# EAGLE schematic schem (EAGLE 6.5.0)
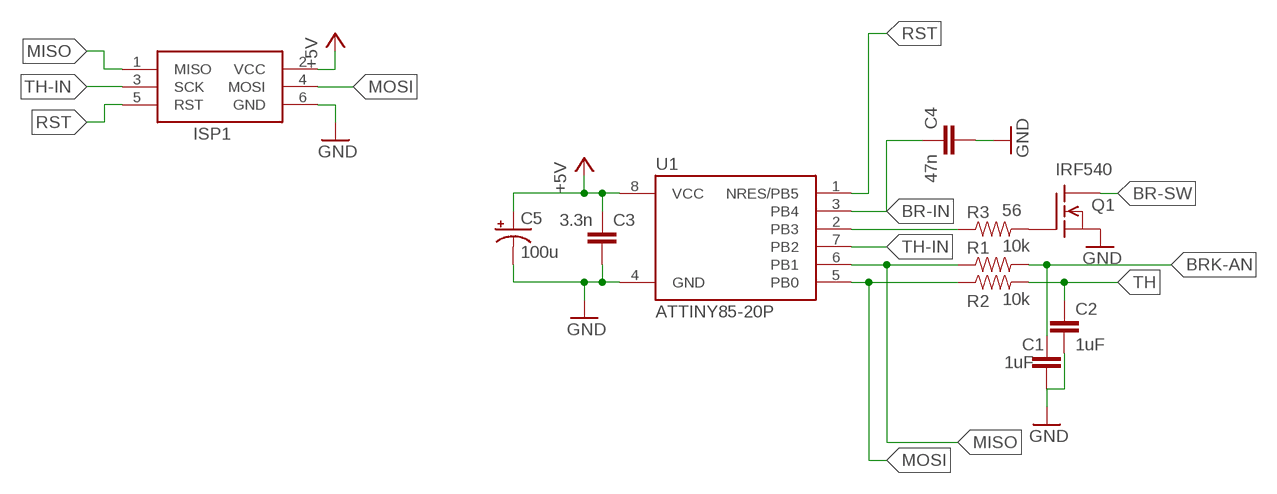
[diagram p0: schematic, sheet 1]

## Parts
C1  1uF  C2.5/6  [C2.5-6]
C2  1uF  C2.5/6  [C2.5-6]
C3  3.3n  CAPEZ  [CAP-PTH-SMALLEZ]
C4  47n  CAPEZ  [CAP-PTH-SMALLEZ]
C5  100u  CPOL-USE2-5  [E2-5]
ISP1  AVRISP-6  [AVRISP]
Q1  IRF540  [TO220]
R1  10k  RESISTORAXIAL-0.3  [AXIAL-0.3]
R2  10k  RESISTORAXIAL-0.3  [AXIAL-0.3]
R3  56  RESISTORAXIAL-0.3  [AXIAL-0.3]
U1  ATTINY85-20P  [PDIP08_300MIL]

## Nets
+5V: C3.1 C5.+ ISP1.2(VCC) U1.8(VCC)
BR-IN: C4.1 U1.3(PB4)
BR-SW: Q1.2(D)
BRK-AN: C1.1 R1.P$2
GND: C2.2 C3.2 C4.2 C5.- ISP1.6(GND) Q1.3(S) U1.4(GND)
MISO: ISP1.1(MISO) R1.P$1 U1.6(PB1)
MOSI: ISP1.4(MOSI) R2.P$1 U1.5(PB0)
N$1: R3.P$1 U1.2(PB3)
N$2: Q1.1(G) R3.P$2
RST: ISP1.5(RST) U1.1(NRES/PB5)
TH: C2.1 R2.P$2
TH-IN: ISP1.3(SCK) U1.7(PB2)
Unconnected: C1.2

## Library data of the parts
C1 C2 = capacitor-wima:C: CAPACITOR naming: grid - package width
C3 C4 = SparkFun-Capacitors:CAP: Capacitor Standard 0603 ceramic capacitor, and 0.1" leaded capacitor.
C5 = resistor:CPOL-US: POLARIZED CAPACITOR, American symbol
ISP1 = adafruit:AVRISP: AVR ISP HEADER Standard 6 pin header for AVR programming
Q1 = transistor-fet:IRF540: N-Channel Enhancement MOSFET (HEXFET); 100V; 28A; 0,077Ohm
R1-R3 = SparkFun-Passives:RESISTOR: Resistor Basic schematic elements and footprints for 0603, 1206, and PTH resistors.
U1 = _hhn_attiny25_45_85:ATTINY85*: ATMEL ATtiny 85 Packages: P = PDIP 08 30mil S = SOIC 08 EIAJ 208mil Technologies Note: for complete ordering code (temp. range, finish, tape&reel etc.) see www.atmel.com • Supply Voltage: V = (1.8…5.5)V | [blank] = (2.7…5.5)V • Speed: 10 = 10 MHz | 20 = 20 MHz Author: Dipl.-Ing. FH Rainer Bayer HHN Hochschule Heilbronn (Heilbronn University), rainer.bayer@hs-heilbronn.de Ingenieurbüro ing-rb, mail@ing-rb.de